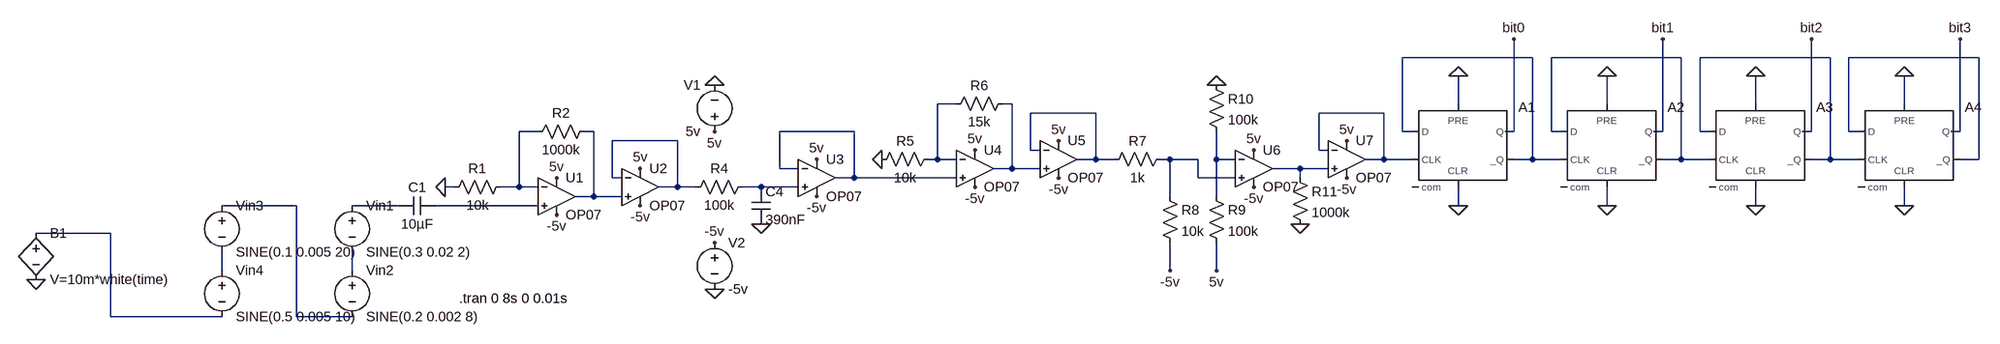
[diagram p0: schematic Pedometer with LTSpice.asc]
Pedometer with LTSpice.asc, the LTspice schematic file:
Version 4
SHEET 1 2820 680
WIRE 1536 -416 1312 -416
WIRE 1792 -416 1568 -416
WIRE 2048 -416 1824 -416
WIRE 2304 -416 2080 -416
WIRE 544 -336 512 -336
WIRE 640 -336 624 -336
WIRE 1408 -336 1408 -384
WIRE 1664 -336 1664 -384
WIRE 1920 -336 1920 -384
WIRE 2176 -336 2176 -384
WIRE 784 -320 672 -320
WIRE 1280 -320 1168 -320
WIRE -176 -288 -208 -288
WIRE -80 -288 -96 -288
WIRE 368 -288 240 -288
WIRE 1312 -288 1312 -416
WIRE 1328 -288 1312 -288
WIRE 1504 -288 1504 -448
WIRE 1504 -288 1488 -288
WIRE 1568 -288 1568 -416
WIRE 1584 -288 1568 -288
WIRE 1760 -288 1760 -448
WIRE 1760 -288 1744 -288
WIRE 1824 -288 1824 -416
WIRE 1840 -288 1824 -288
WIRE 2016 -288 2016 -448
WIRE 2016 -288 2000 -288
WIRE 2080 -288 2080 -416
WIRE 2096 -288 2080 -288
WIRE 2272 -288 2272 -448
WIRE 2272 -288 2256 -288
WIRE 64 -272 -48 -272
WIRE 672 -256 672 -320
WIRE 688 -256 672 -256
WIRE 1168 -256 1168 -320
WIRE 1184 -256 1168 -256
WIRE 512 -240 512 -336
WIRE 512 -240 496 -240
WIRE 544 -240 512 -240
WIRE 784 -240 784 -320
WIRE 784 -240 752 -240
WIRE 816 -240 784 -240
WIRE 912 -240 896 -240
WIRE 960 -240 912 -240
WIRE 992 -240 992 -288
WIRE 1024 -240 992 -240
WIRE 1280 -240 1280 -320
WIRE 1280 -240 1248 -240
WIRE 1328 -240 1280 -240
WIRE 1536 -240 1536 -416
WIRE 1536 -240 1504 -240
WIRE 1584 -240 1536 -240
WIRE 1792 -240 1792 -416
WIRE 1792 -240 1760 -240
WIRE 1840 -240 1792 -240
WIRE 2048 -240 2048 -416
WIRE 2048 -240 2016 -240
WIRE 2096 -240 2048 -240
WIRE 2304 -240 2304 -416
WIRE 2304 -240 2272 -240
WIRE 240 -224 240 -288
WIRE 272 -224 240 -224
WIRE 640 -224 640 -336
WIRE 640 -224 608 -224
WIRE 688 -224 640 -224
WIRE 1136 -224 1088 -224
WIRE 1184 -224 1136 -224
WIRE -48 -208 -48 -272
WIRE -32 -208 -48 -208
WIRE 368 -208 368 -288
WIRE 368 -208 336 -208
WIRE 544 -208 368 -208
WIRE 960 -208 960 -240
WIRE 1024 -208 960 -208
WIRE 1136 -208 1136 -224
WIRE -320 -192 -336 -192
WIRE -208 -192 -208 -288
WIRE -208 -192 -240 -192
WIRE -176 -192 -208 -192
WIRE 64 -192 64 -272
WIRE 64 -192 32 -192
WIRE 96 -192 64 -192
WIRE 208 -192 176 -192
WIRE 272 -192 208 -192
WIRE -80 -176 -80 -288
WIRE -80 -176 -112 -176
WIRE -32 -176 -80 -176
WIRE 912 -176 912 -240
WIRE 992 -176 992 -240
WIRE -592 -160 -720 -160
WIRE -416 -160 -496 -160
WIRE -176 -160 -352 -160
WIRE 1408 -160 1408 -192
WIRE 1664 -160 1664 -192
WIRE 1920 -160 1920 -192
WIRE 2176 -160 2176 -192
WIRE -912 -112 -1040 -112
WIRE -720 -48 -720 -80
WIRE -496 -48 -496 -80
WIRE 912 -48 912 -96
WIRE 992 -48 992 -96
WIRE -912 32 -912 -112
WIRE -720 32 -912 32
WIRE -592 32 -592 -160
WIRE -496 32 -592 32
FLAG 208 -128 0
FLAG -336 -192 0
FLAG 128 -368 0
FLAG 128 -16 0
FLAG 416 -240 0
FLAG 992 -368 0
FLAG 1136 -128 0
FLAG -144 -208 5v
FLAG 128 -288 5v
FLAG 0 -224 5v
FLAG -144 -144 -5v
FLAG 0 -160 -5v
FLAG 128 -96 -5v
FLAG 304 -240 5v
FLAG 304 -176 -5v
FLAG 576 -256 5v
FLAG 576 -192 -5v
FLAG 720 -272 5v
FLAG 720 -208 -5v
FLAG 1056 -256 5v
FLAG 992 -48 5v
FLAG 1216 -272 5v
FLAG 1216 -208 -5v
FLAG 1504 -448 bit0
FLAG 1760 -448 bit1
FLAG 2016 -448 bit2
FLAG 2272 -448 bit3
FLAG 1408 -160 0
FLAG 1664 -160 0
FLAG 1920 -160 0
FLAG 2176 -160 0
FLAG 1408 -384 0
FLAG 1664 -384 0
FLAG 1920 -384 0
FLAG 2176 -384 0
FLAG 1056 -192 -5v
FLAG 912 -48 -5v
FLAG -1040 -32 0
SYMBOL res 192 -208 R90
WINDOW 0 0 56 VBottom 2
WINDOW 3 32 56 VTop 2
SYMATTR InstName R4
SYMATTR Value 100k
SYMBOL cap 192 -192 R0
SYMATTR InstName C4
SYMATTR Value 390nF
SYMBOL OpAmps\\OP07 -144 -240 R0
SYMATTR InstName U1
SYMBOL res -80 -304 R90
WINDOW 0 0 56 VBottom 2
WINDOW 3 32 56 VTop 2
SYMATTR InstName R2
SYMATTR Value 1000k
SYMBOL res -224 -208 R90
WINDOW 0 0 56 VBottom 2
WINDOW 3 32 56 VTop 2
SYMATTR InstName R1
SYMATTR Value 10k
SYMBOL voltage -496 -176 R0
WINDOW 123 0 0 Left 0
WINDOW 39 0 0 Left 0
SYMATTR InstName Vin1
SYMATTR Value SINE(0.3 0.02 2)
SYMBOL voltage 128 -112 R0
SYMATTR InstName V2
SYMATTR Value -5v
SYMBOL voltage 128 -272 R180
WINDOW 0 24 96 Left 2
WINDOW 3 24 16 Left 2
SYMATTR InstName V1
SYMATTR Value 5v
SYMBOL OpAmps\\OP07 576 -288 R0
SYMATTR InstName U4
SYMBOL res 640 -352 R90
WINDOW 0 0 56 VBottom 2
WINDOW 3 32 56 VTop 2
SYMATTR InstName R6
SYMATTR Value 15k
SYMBOL res 512 -256 R90
WINDOW 0 0 56 VBottom 2
WINDOW 3 32 56 VTop 2
SYMATTR InstName R5
SYMATTR Value 10k
SYMBOL res 976 -192 R0
SYMATTR InstName R9
SYMATTR Value 100k
SYMBOL OpAmps\\OP07 1056 -288 R0
SYMATTR InstName U6
SYMBOL res 976 -384 R0
SYMATTR InstName R10
SYMATTR Value 100k
SYMBOL res 1120 -224 R0
SYMATTR InstName R11
SYMATTR Value 1000k
SYMBOL OpAmps\\OP07 0 -256 R0
SYMATTR InstName U2
SYMBOL OpAmps\\OP07 304 -272 R0
SYMATTR InstName U3
SYMBOL OpAmps\\OP07 720 -304 R0
SYMATTR InstName U5
SYMBOL OpAmps\\OP07 1216 -304 R0
SYMATTR InstName U7
SYMBOL Digital\\dflop 1408 -336 R0
SYMATTR InstName A1
SYMBOL Digital\\dflop 1664 -336 R0
SYMATTR InstName A2
SYMBOL Digital\\dflop 1920 -336 R0
SYMATTR InstName A3
SYMBOL Digital\\dflop 2176 -336 R0
SYMATTR InstName A4
SYMBOL res 912 -256 R90
WINDOW 0 0 56 VBottom 2
WINDOW 3 32 56 VTop 2
SYMATTR InstName R7
SYMATTR Value 1k
SYMBOL res 896 -192 R0
SYMATTR InstName R8
SYMATTR Value 10k
SYMBOL cap -352 -176 R90
WINDOW 0 0 32 VBottom 2
WINDOW 3 32 32 VTop 2
SYMATTR InstName C1
SYMATTR Value 10µF
SYMBOL voltage -496 -64 R0
WINDOW 123 0 0 Left 0
WINDOW 39 0 0 Left 0
SYMATTR InstName Vin2
SYMATTR Value SINE(0.2 0.002 8)
SYMBOL voltage -720 -176 R0
WINDOW 123 0 0 Left 0
WINDOW 39 0 0 Left 0
SYMATTR InstName Vin3
SYMATTR Value SINE(0.1 0.005 20)
SYMBOL voltage -720 -64 R0
WINDOW 123 0 0 Left 0
WINDOW 39 0 0 Left 0
SYMATTR InstName Vin4
SYMATTR Value SINE(0.5 0.005 10)
SYMBOL bv -1040 -128 R0
SYMATTR InstName B1
SYMATTR Value V=10m*white(time)
TEXT -312 0 Left 2 !.tran 0 8s 0 0.01s

The netlist it stands for:
* Pedometer with LTSpice.asc
R4 N016 N012 100k
C4 N016 0 390nF
XU1 N019 N009 5v -5v N010 LT1001  ; OP07, pins In+ In- V+ V- OUT
R2 N010 N009 1000k
R1 N009 0 10k
Vin1 N018 N022 SINE(0.3 0.02 2)
V2 -5v 0 -5v
V1 5v 0 5v
XU4 N011 N005 5v -5v N006 LT1001  ; OP07, pins In+ In- V+ V- OUT
R6 N006 N005 15k
R5 N005 0 10k
R9 N014 5v 100k
XU6 N013 N014 5v -5v N015 LT1001  ; OP07, pins In+ In- V+ V- OUT
R10 0 N014 100k
R11 N015 0 1000k
XU2 N010 N012 5v -5v N012 LT1001  ; OP07, pins In+ In- V+ V- OUT
XU3 N016 N011 5v -5v N011 LT1001  ; OP07, pins In+ In- V+ V- OUT
XU5 N006 N007 5v -5v N007 LT1001  ; OP07, pins In+ In- V+ V- OUT
XU7 N015 N008 5v -5v N008 LT1001  ; OP07, pins In+ In- V+ V- OUT
A1 N001 0 N008 0 0 N001 bit0 0 DFLOP
A2 N002 0 N001 0 0 N002 bit1 0 DFLOP
A3 N003 0 N002 0 0 N003 bit2 0 DFLOP
A4 N004 0 N003 0 0 N004 bit3 0 DFLOP
R7 N013 N007 1k
R8 N013 -5v 10k
C1 N019 N018 10µF
Vin2 N022 N017 SINE(0.2 0.002 8)
Vin3 N017 N021 SINE(0.1 0.005 20)
Vin4 N021 N020 SINE(0.5 0.005 10)
B1 N020 0 V=10m*white(time)
.tran 0 8s 0 0.01s
.lib LTC.lib
.backanno
.end